# Altium project Coil_Driver.PrjPcb (part 1 of 3)
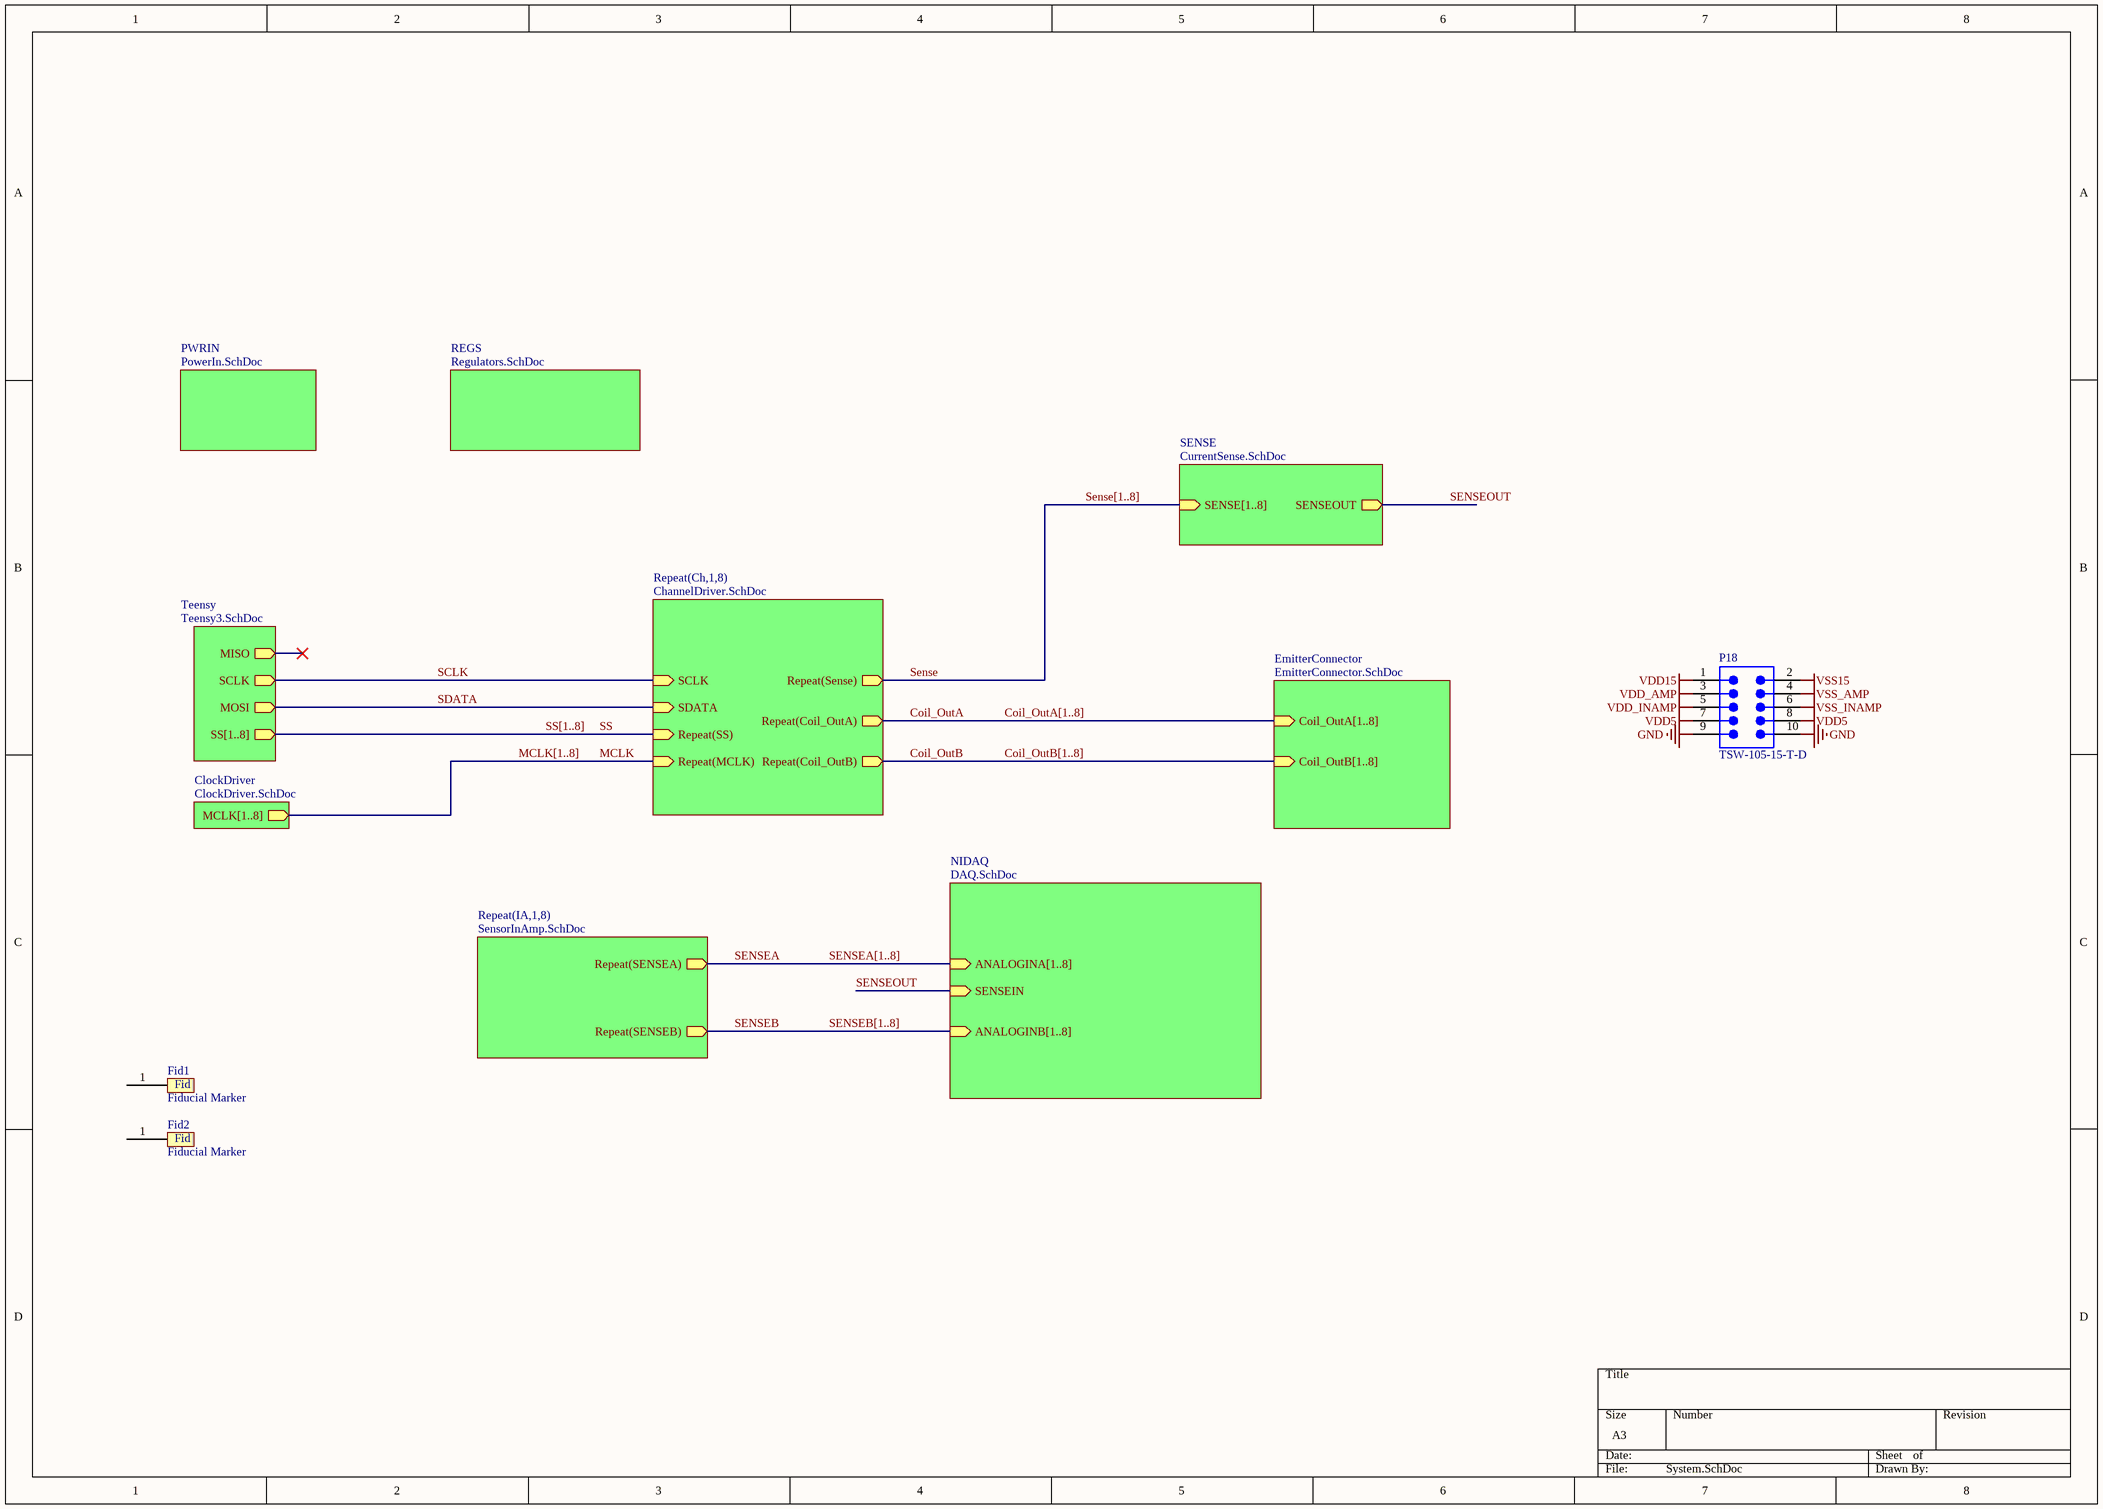
[diagram p0: System.SchDoc]
10 sheets, 1121 parts. Net scope: hierarchical (ports join the sheet entries above them; power ports are global).
Board file: PCB1.PcbDoc
Sheets:
  System.SchDoc
    Ch1 = ChannelDriver.SchDoc
    Ch2 = ChannelDriver.SchDoc
    Ch3 = ChannelDriver.SchDoc
    Ch4 = ChannelDriver.SchDoc
    Ch5 = ChannelDriver.SchDoc
    Ch6 = ChannelDriver.SchDoc
    Ch7 = ChannelDriver.SchDoc
    Ch8 = ChannelDriver.SchDoc
    Teensy = Teensy3.SchDoc
    ClockDriver = ClockDriver.SchDoc
    IA1 = SensorInAmp.SchDoc
    IA2 = SensorInAmp.SchDoc
    IA3 = SensorInAmp.SchDoc
    IA4 = SensorInAmp.SchDoc
    IA5 = SensorInAmp.SchDoc
    IA6 = SensorInAmp.SchDoc
    IA7 = SensorInAmp.SchDoc
    IA8 = SensorInAmp.SchDoc
    EmitterConnector = EmitterConnector.SchDoc
    NIDAQ = DAQ.SchDoc
    PWRIN = PowerIn.SchDoc
    REGS = Regulators.SchDoc
    SENSE = CurrentSense.SchDoc

## Sheet System.SchDoc
size A3

### Parts
Fid1  Fiducial Marker  [Fiducial]  (no BOM)
Fid2  Fiducial Marker  [Fiducial]  (no BOM)
P18  TSW-105-15-T-D  [SMTC-TSW-105-15-X-D]

### Sub-sheets
ClockDriver = ClockDriver.SchDoc: MCLK[1..8] (out)
EmitterConnector = EmitterConnector.SchDoc: Coil_OutA[1..8] (in), Coil_OutB[1..8] (in)
NIDAQ = DAQ.SchDoc: ANALOGINB[1..8] (in), ANALOGINA[1..8] (in), SENSEIN (in)
PWRIN = PowerIn.SchDoc: no entries
REGS = Regulators.SchDoc: no entries
Repeat(Ch,1,8) = ChannelDriver.SchDoc: SCLK (in), SDATA (in), Repeat(SS) (in), Repeat(MCLK) (in), Repeat(Coil_OutA) (out), Repeat(Coil_OutB) (out), Repeat(Sense) (out)
Repeat(IA,1,8) = SensorInAmp.SchDoc: Repeat(SENSEB) (out), Repeat(SENSEA) (out)
SENSE = CurrentSense.SchDoc: SENSE[1..8] (in), SENSEOUT (out)
Teensy = Teensy3.SchDoc: MOSI (out), SS[1..8] (out), SCLK (out), MISO (out)

### Nets
GND: P18.9 P18.10
VDD5: P18.7 P18.8
VDD15: P18.1
VDD_AMP: P18.3
VDD_INAMP: P18.5
VSS15: P18.2
VSS_AMP: P18.4
VSS_INAMP: P18.6
Coil_OutA: sheet Repeat(Ch,1,8)/Repeat(Coil_OutA)
Coil_OutB: sheet Repeat(Ch,1,8)/Repeat(Coil_OutB)
MCLK: sheet Repeat(Ch,1,8)/Repeat(MCLK)
SCLK: sheet Repeat(Ch,1,8)/SCLK, sheet Teensy/SCLK
SDATA: sheet Repeat(Ch,1,8)/SDATA, sheet Teensy/MOSI  [project net MOSI]
Sense: sheet Repeat(Ch,1,8)/Repeat(Sense)
SENSEA: sheet Repeat(IA,1,8)/Repeat(SENSEA)
SENSEB: sheet Repeat(IA,1,8)/Repeat(SENSEB)
SENSEOUT: sheet NIDAQ/SENSEIN, sheet SENSE/SENSEOUT  [project net SENSEIN]
SS: sheet Repeat(Ch,1,8)/Repeat(SS)

Not connected (* = marked no-connect by the designer): Fid1 1; Fid2 1

### Buses and harness runs
bus Coil_OutA[1..8] = sheet EmitterConnector/Coil_OutA[1..8]
bus Coil_OutB[1..8] = sheet EmitterConnector/Coil_OutB[1..8]
bus MCLK[1..8] = sheet ClockDriver/MCLK[1..8]
bus Sense[1..8] = sheet SENSE/SENSE[1..8]
bus SENSEA[1..8] = sheet NIDAQ/ANALOGINA[1..8]
bus SENSEB[1..8] = sheet NIDAQ/ANALOGINB[1..8]
bus SS[1..8] = sheet Teensy/SS[1..8]

### Notes on the sheet
- (in symbol Fiducial Marker) Fid

### Library data of the parts
P18 = CMP-1024-00368-1: Manufacturer: Samtec; Pitch: 2.54 mm; DatasheetVersion: F-214; PackageDescription: .025[0.64] SQ. Post Terminal Strip Assembly; PartNumber: TSW-105-15-T-D; PackageReference: TSW-105-15-X-D; ComponentLink2URL: http://www.samtec.com/documents/webfiles/pdf/TSW_TH.PDF; ComponentLink1URL: http://www.samtec.com; ComponentLink2Description: Datasheet; ComponentLink3Description: Package Specification; PackageVersion: DM, 8/1988; Mounting Technology: Through-hole; Temperature Range: -55 to 105 degC; ComponentLink1Description: Manufacturer URL; RoHS: True; ComponentLink3URL: http://www.samtec.com/documents/webfiles/cpdf/TSW-XXX-XX-XXX-X-XX-XXX-MKT.pdf; Orientation: Vertical

## Sheet ChannelDriver.SchDoc
size A3
Used 8 times, as channels Ch1, Ch2, Ch3, Ch4, Ch5, Ch6, Ch7, Ch8. Parts and nets are listed once, with the designators drawn on the sheet.
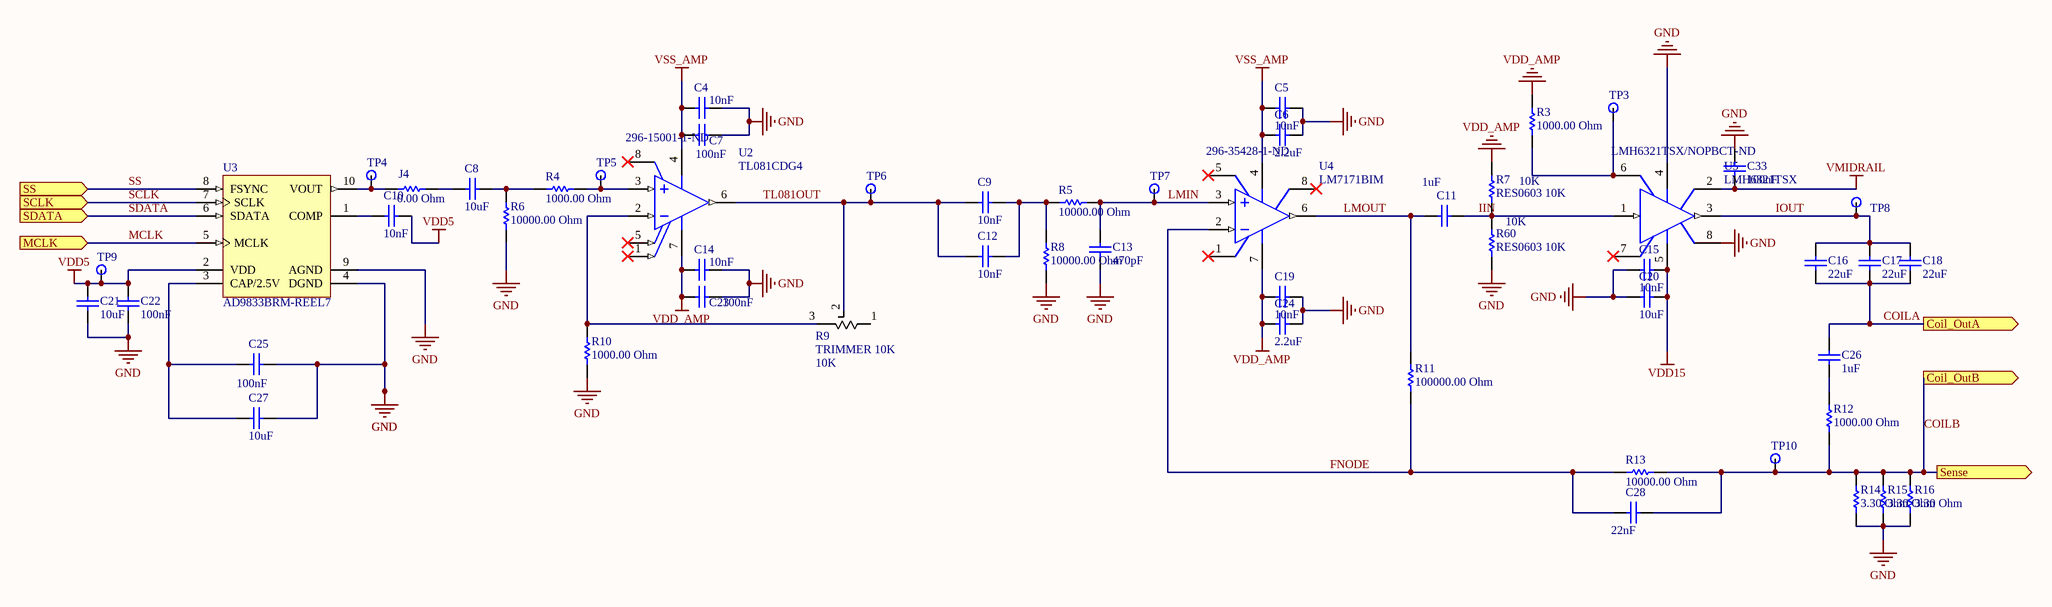
[diagram p1: ChannelDriver.SchDoc]

### Parts
C4  value 10nF  [CAPC0603(1608)100_N]  (hidden comment: CAP 10nF 25V 0603(1608))
C5  value 10nF  [CAPC0603(1608)100_N]  (hidden comment: CAP 10nF 25V 0603(1608))
C6  value 2.2uF  [CAPC0603(1608)100_M]  (hidden comment: CAP 2.2uF 25V 0603(1608))
C7  value 100nF  [CAPC0603(1608)100_M]  (hidden comment: CAP 100nF 25V 0603(1608))
C8  value 10uF  [CAPC1206(3216)190_L]  (hidden comment: CAP 10uF 25V 1206(3216))
C9  value 10nF  [CAPC0603(1608)100_N]  (hidden comment: CAP 10nF 25V 0603(1608))
C10  value 10nF  [CAPC0603(1608)100_N]  (hidden comment: CAP 10nF 25V 0603(1608))
C11  value 1uF  [CAPC0603(1608)100_L]  (hidden comment: CAP 1uF 25V 0603(1608))
C12  value 10nF  [CAPC0603(1608)100_N]  (hidden comment: CAP 10nF 25V 0603(1608))
C13  value 470pF  [CAPC0603(1608)100_N]  (hidden comment: CAP 470pF 25V 0603(1608))
C14  value 10nF  [CAPC0603(1608)100_N]  (hidden comment: CAP 10nF 25V 0603(1608))
C15  value 10nF  [CAPC0603(1608)100_N]  (hidden comment: CAP 10nF 25V 0603(1608))
C16  value 22uF  [CAPC1206(3216)190_M]  (hidden comment: CAP 22uF 25V 1206(3216))
C17  value 22uF  [CAPC1206(3216)190_M]  (hidden comment: CAP 22uF 25V 1206(3216))
C18  value 22uF  [CAPC1206(3216)190_M]  (hidden comment: CAP 22uF 25V 1206(3216))
C19  value 10nF  [CAPC0603(1608)100_N]  (hidden comment: CAP 10nF 25V 0603(1608))
C20  value 10uF  [CAPC1206(3216)190_L]  (hidden comment: CAP 10uF 25V 1206(3216))
C21  value 10uF  [CAPC1206(3216)190_L]  (hidden comment: CAP 10uF 25V 1206(3216))
C22  value 100nF  [CAPC0603(1608)100_M]  (hidden comment: CAP 100nF 25V 0603(1608))
C23  value 100nF  [CAPC0603(1608)100_M]  (hidden comment: CAP 100nF 25V 0603(1608))
C24  value 2.2uF  [CAPC0603(1608)100_M]  (hidden comment: CAP 2.2uF 25V 0603(1608))
C25  value 100nF  [CAPC0603(1608)100_M]  (hidden comment: CAP 100nF 25V 0603(1608))
C26  value 1uF  [CAPC0603(1608)100_L]  (hidden comment: CAP 1uF 25V 0603(1608))
C27  value 10uF  [CAPC1206(3216)190_L]  (hidden comment: CAP 10uF 25V 1206(3216))
C28  value 22nF  [CAPC0603(1608)100_N]  (hidden comment: CAP 22nF 25V 0603(1608))
C33  value 100nF  [CAPC0603(1608)100_M]  (hidden comment: CAP 100nF 25V 0603(1608))
J4  0.00 Ohm  [RESC1206(3216)_M]
R3  value 1000.00 Ohm  [RESC0603(1608)_L]  (hidden comment: 1K 5% 0603(1608))
R4  value 1000.00 Ohm  [RESC0603(1608)_L]  (hidden comment: 1K 5% 0603(1608))
R5  value 10000.00 Ohm  [RESC0603(1608)_N]  (hidden comment: 10K 5% 0603(1608))
R6  value 10000.00 Ohm  [RESC0603(1608)_N]  (hidden comment: 10K 5% 0603(1608))
R7  RES0603 10K  value 10K  [RESC0603(1608)_L]
R8  value 10000.00 Ohm  [RESC0603(1608)_N]  (hidden comment: 10K 5% 0603(1608))
R9  TRIMMER 10K  value 10K  [TRIMMER 10K]
R10  value 1000.00 Ohm  [RESC0603(1608)_L]  (hidden comment: 1K 5% 0603(1608))
R11  value 100000.00 Ohm  [RESC0603(1608)_N]  (hidden comment: 100K 5% 0603(1608))
R12  value 1000.00 Ohm  [RESC0603(1608)_L]  (hidden comment: 1K 5% 0603(1608))
R13  value 10000.00 Ohm  [RESC0603(1608)_N]  (hidden comment: 10K 5% 0603(1608))
R14  3.30 Ohm  [RESC1206(3216)_N]
R15  3.30 Ohm  [RESC1206(3216)_N]
R16  3.30 Ohm  [RESC1206(3216)_N]
R60  RES0603 10K  value 10K  [RESC0603(1608)_L]
TP3  Testpoint  [0603 PROBE PAD]  (value not drawn)
TP4  Testpoint  [0603 PROBE PAD]  (value not drawn)
TP5  Testpoint  [0603 PROBE PAD]  (value not drawn)
TP6  Testpoint  [0603 PROBE PAD]  (value not drawn)
TP7  Testpoint  [0603 PROBE PAD]  (value not drawn)
TP8  Testpoint  [0603 PROBE PAD]  (value not drawn)
TP9  Testpoint  [0603 PROBE PAD]  (value not drawn)
TP10  Testpoint  [0603 PROBE PAD]  (value not drawn)
U2  TL081CDG4  Supplier Part Number 1: 296-15001-1-ND  [TI-D8_N]
U3  AD9833BRM-REEL7  [ADI-RM-10_L]
U4  LM7171BIM  Supplier Part Number 1: 296-35428-1-ND  [D0008A_L]
U5  LMH6321TSX  Supplier Part Number 1: LMH6321TSX/NOPBCT-ND  [TS7B_N]

### Ports
Coil_OutA (out), Coil_OutB (out), MCLK (in), SCLK (in), SDATA (in), Sense (out), SS (in)

### Nets
GND: C4.2 C5.2 C6.2 C7.1 C13.1 C14.2 C15.1 C19.2 C20.2 C21.1 C22.2 C23.1 C24.2 C25.1 C27.1 C33.1 R6.2 R8.2 R10.2 R14.1 R15.1 R16.1 R60.1 U3.4(DGND) U3.9(AGND) U5.4(V-) U5.8(TAB)
VDD5: C10.2 C21.2 C22.1 TP9.0 U3.2(VDD)
VDD15: C15.2 C20.1 U5.5(V+)
VDD_AMP: C14.1 C19.1 C23.2 C24.1 R3.1 R7.2 U2.7(VCC+) U4.7(V+)
VMIDRAIL: C33.2 U5.2(GND)
VSS_AMP: C4.1 C5.1 C6.1 C7.2 U2.4(VCC-) U4.4(V-)
COILA: C16.2 C17.2 C18.2 C26.2 ; port Coil_OutA
COILB: C28.2 R12.2 R13.1 R14.2 R15.2 R16.2 TP10.0 ; port Coil_OutB, port Sense
FNODE: C28.1 R11.2 R13.2 U4.2(IN-)
IIN: C11.2 R7.1 R60.2 U5.1(IN)
IOUT: C16.1 C17.1 C18.1 TP8.0 U5.3(OUT)
LMIN: C13.2 R5.1 TP7.0 U4.3(IN+)
LMOUT: C11.1 R11.1 U4.6(OUT)
MCLK: U3.5(MCLK) ; port MCLK
SCLK: U3.7(SCLK) ; port SCLK
SDATA: U3.6(SDATA) ; port SDATA
SS: U3.8(FSYNC) ; port SS
TL081OUT: C9.1 C12.1 R9.2 TP6.0 U2.6(OUT)
NetC8_1: C8.1 R4.2 R6.1
NetC8_2: C8.2 J4.2
NetC9_2: C9.2 C12.2 R5.2 R8.1
NetC10_1: C10.1 U3.1(COMP)
NetC25_2: C25.2 C27.2 U3.3(CAP/2.5V)
NetC26_1: C26.1 R12.1
NetJ4_1: J4.1 TP4.0 U3.10(VOUT)
NetR3_2: R3.2 TP3.0 U5.6(EF)
NetR4_1: R4.1 TP5.0 U2.3(IN+)
NetR9_3: R9.3 R10.1 U2.2(IN-)

Not connected (* = marked no-connect by the designer): R9 1; U2 1(OFFSET_N1)* 5(OFFSET_N2)* 8(NC)*; U4 1(NC)* 5(NC)* 8(NC)*; U5 7(CL)*

### Channels
Ch1: designators end in _Ch1; ports Coil_OutA=Coil_Out1 Coil_OutB=Coil_In1 MCLK=MCLK SCLK=SCLK SDATA=MOSI Sense=Coil_In1 SS=SS
Ch2: designators end in _Ch2; ports Coil_OutA=Coil_Out2 Coil_OutB=Coil_In2 MCLK=MCLK SCLK=SCLK SDATA=MOSI Sense=Coil_In2 SS=SS
Ch3: designators end in _Ch3; ports Coil_OutA=Coil_Out3 Coil_OutB=Coil_In3 MCLK=MCLK SCLK=SCLK SDATA=MOSI Sense=Coil_In3 SS=SS
Ch4: designators end in _Ch4; ports Coil_OutA=Coil_Out4 Coil_OutB=Coil_In4 MCLK=MCLK SCLK=SCLK SDATA=MOSI Sense=Coil_In4 SS=SS
Ch5: designators end in _Ch5; ports Coil_OutA=Coil_Out5 Coil_OutB=Coil_In5 MCLK=MCLK SCLK=SCLK SDATA=MOSI Sense=Coil_In5 SS=SS
Ch6: designators end in _Ch6; ports Coil_OutA=Coil_Out6 Coil_OutB=Coil_In6 MCLK=MCLK SCLK=SCLK SDATA=MOSI Sense=Coil_In6 SS=SS
Ch7: designators end in _Ch7; ports Coil_OutA=Coil_Out7 Coil_OutB=Coil_In7 MCLK=MCLK SCLK=SCLK SDATA=MOSI Sense=Coil_In7 SS=SS
Ch8: designators end in _Ch8; ports Coil_OutA=Coil_Out8 Coil_OutB=Coil_In8 MCLK=MCLK SCLK=SCLK SDATA=MOSI Sense=Coil_In8 SS=SS

### Library data of the parts
C4 C5 C9 C10 C12 C14 C15 C19 = CMP-1035-02317-1: CAP 10nF 25V ±10% 0603 (1608 Metric) Thickness 1mm SMD; Tolerance: Â±10%; Case-Metric: 1608; Case-EIA: 0603; Max Thickness: 1 mm; Rated Voltage: 25 V; Technology: SMT; OrderURL: http://www.digikey.ie/product-detail/en/yageo/CC0603KRX7R8BB103/311-1360-1-ND/2103144; Supplier 1: Digi-Key; Supplier Part Number 1: 311-1360-1-ND
C6 C24 = CMP-1035-02767-1: CAP 2.2uF 25V ±10% 0603 (1608 Metric) Thickness 1mm SMD; Manufacturer: Taiyo Yuden; Manufacturer Part Number: TMK107ABJ225KA-T; Case-EIA: 0603; Tolerance: Â±10%; Case-Metric: 1608; Capacitance: 2.2µF; Temperature Coefficient: X5R; Technology: SMT; Max Thickness: 1 mm; Rated Voltage: 25 V; OrderURL: http://www.digikey.ie/product-detail/en/taiyo-yuden/TMK107ABJ225KA-T/587-2909-1-ND/2649029; Supplier 1: Digi-Key; Supplier Part Number 1: 587-2909-1-ND; RoHS: RoHS Compliant; Category: Capacitors; Stock 1: 107583; Pricing 1: 1=0.16, 10=0.112, 25=0.0816, 50=0.0632, 100=0.0525, 250=0.04344, 500=0.03678, 1000=0.03045 (EUR); Packaging: Cut Tape (CT); Part Status: Active; Voltage - Rated: 25V; Operating Temperature: -55°C ~ 85°C; Features: -; Ratings: -; Applications: General Purpose; Mounting Type: Surface Mount, MLCC; Package / Case: 0603 (1608 Metric); Size / Dimension: 0.063" L x 0.031" W (1.60mm x 0.80mm); Height - Seated (Max): -; Thickness (Max): 0.035" (0.90mm); Lead Spacing: -; Lead Style: -; ComponentLink1URL: http://ds.yuden.co.jp/TYCOMPAS/ut/detail.do?productNo=TMK107ABJ225KA-T&fileName=TMK107ABJ225KA-T_SS&mode=specSheetDownload; ComponentLink1Description: http://ds.yuden.co.jp/TYCOMPAS/ut/detail.do?productNo=TMK107ABJ225KA-T&fileName=TMK107ABJ225KA-T_SS&mode=specSheetDownload
C7 C22 C23 C25 C33 = CMP-1035-02588-1: CAP 100nF 25V ±10% 0603 (1608 Metric) Thickness 1mm SMD; Case-Metric: 1608; Case-EIA: 0603; Tolerance: Â±10%; Max Thickness: 1 mm; Technology: SMT; Rated Voltage: 25 V; OrderURL: http://www.digikey.ie/product-detail/en/yageo/CC0603KRX7R8BB104/311-1341-1-ND/2103125; Supplier 1: Digi-Key; Supplier Part Number 1: 311-1341-1-ND
C8 C20 C21 C27 = CMP-1037-04979-1: CAP 10uF 25V ±10% 1206 (3216 Metric) Thickness 1.9mm SMD; Case-EIA: 1206; Tolerance: Â±10%; Case-Metric: 3216; Rated Voltage: 25 V; Technology: SMT; Max Thickness: 1.9 mm; OrderURL: http://www.digikey.ie/product-detail/en/murata-electronics-north-america/GRM319R61E106KA12D/490-5525-1-ND/2334921; Supplier 1: Digi-Key; Supplier Part Number 1: 490-5525-1-ND
C11 C26 = CMP-1035-02740-1: CAP 1uF 25V ±10% 0603 (1608 Metric) Thickness 1mm SMD; Tolerance: Â±10%; Case-Metric: 1608; Case-EIA: 0603; Technology: SMT; Rated Voltage: 25 V; Max Thickness: 1 mm; OrderURL: http://www.digikey.ie/product-detail/en/taiyo-yuden/TMK107BJ105KA-T/587-1248-1-ND/931025; Supplier Part Number 1: 587-1248-1-ND; Supplier 1: Digi-Key
C13 = CMP-1035-01671-1: CAP 470pF 25V ±10% 0603 (1608 Metric) Thickness 1mm SMD; Manufacturer: KEMET; Manufacturer Part Number: C0603C471K3RACTU; Case-EIA: 0603; Tolerance: Â±10%; Case-Metric: 1608; Temperature Coefficient: X7R; Technology: SMT; Max Thickness: 1 mm; Rated Voltage: 25 V; OrderURL: http://www.digikey.ie/product-detail/en/kemet/C0603C471K3RACTU/399-9086-1-ND/3522603; Supplier 1: Digi-Key; Supplier Part Number 1: 399-9086-1-ND; RoHS: RoHS Compliant; Category: Capacitors; Stock 1: 50558; Pricing 1: 1=0.09, 10=0.044, 25=0.032, 50=0.024, 100=0.0196, 250=0.01644, 500=0.01402, 1000=0.01102 (EUR); Packaging: Cut Tape (CT); Part Status: Active; Capacitance: 470pF; Voltage - Rated: 25V; Operating Temperature: -55°C ~ 125°C; Features: -; Ratings: -; Applications: General Purpose; Failure Rate: -; Mounting Type: Surface Mount, MLCC; Package / Case: 0603 (1608 Metric); Size / Dimension: 0.063" L x 0.031" W (1.60mm x 0.80mm); Height - Seated (Max): -; Thickness (Max): 0.034" (0.87mm); Lead Spacing: -; Lead Style: -; ComponentLink1URL: http://www.kemet.com/docfinder?Partnumber=C0603C471K3RACTU; ComponentLink1Description: http://www.kemet.com/docfinder?Partnumber=C0603C471K3RACTU
C16-C18 = CMP-1037-04995-1: CAP 22uF 25V ±20% 1206 (3216 Metric) Thickness 1.9mm SMD; Case-EIA: 1206; Tolerance: Â±20%; Case-Metric: 3216; Rated Voltage: 25 V; Technology: SMT; Max Thickness: 1.9 mm; OrderURL: http://www.digikey.ie/product-detail/en/taiyo-yuden/TMK316BBJ226ML-T/587-3246-1-ND/3660105; Supplier Part Number 1: 587-3246-1-ND; Supplier 1: Digi-Key
C28 = CMP-1035-02317-1: CAP 10nF 25V ±10% 0603 (1608 Metric) Thickness 1mm SMD; Manufacturer: Taiyo Yuden; Manufacturer Part Number: TMK107B7223KA-T; Tolerance: Â±10%; Case-Metric: 1608; Case-EIA: 0603; Temperature Coefficient: X7R; Max Thickness: 1 mm; Rated Voltage: 25 V; Technology: SMT; OrderURL: http://www.digikey.ie/product-detail/en/yageo/CC0603KRX7R8BB103/311-1360-1-ND/2103144; Supplier 1: Digi-Key; Supplier Part Number 1: 587-1238-1-ND; RoHS: RoHS Compliant; Category: Capacitors; Stock 1: 40253; Pricing 1: 1=0.08, 10=0.052, 100=0.0232, 500=0.01652, 1000=0.01299 (EUR); Packaging: Cut Tape (CT); Part Status: Active; Voltage - Rated: 25V; Operating Temperature: -55°C ~ 125°C; Features: -; Ratings: -; Applications: General Purpose; Mounting Type: Surface Mount, MLCC; Package / Case: 0603 (1608 Metric); Size / Dimension: 0.063" L x 0.032" W (1.60mm x 0.80mm); Height - Seated (Max): -; Thickness (Max): 0.035" (0.90mm); Lead Spacing: -; Lead Style: -; ComponentLink1URL: http://www.yuden.co.jp/productdata/catalog/en/mlcc_all_e.pdf; ComponentLink1Description: http://www.yuden.co.jp/productdata/catalog/en/mlcc_all_e.pdf
J4 = CMP-1014-00001-1: Jumper 1206 (3216 Metric); Tolerance: None; Case-EIA: 1206; Case-Metric: 3216; Technology: SMT; Power: None; Value: 0.00 Ohm; OrderURL: http://www.digikey.ie/product-detail/en/yageo/RC0603JR-070RL/311-0.0GRCT-ND/729622; Supplier 1: Digi-Key; Supplier Part Number 1: 311-0.0GRCT-ND
R3 R4 R10 R12 = CMP-1012-00074-1: 1K 0.1W 5% 0603 (1608 Metric)  SMD; Case-EIA: 0603; Case-Metric: 1608; Technology: SMT; Tolerance: 5 %; Power: 0.1 W; OrderURL: http://www.digikey.ie/product-detail/en/yageo/RC0603JR-071KL/311-1.0KGRCT-ND/729624; Supplier 1: Digi-Key; Supplier Part Number 1: 311-1.0KGRCT-ND
R5 R6 R8 R13 = CMP-1012-00098-1: 10K 0.1W 5% 0603 (1608 Metric)  SMD; Case-EIA: 0603; Case-Metric: 1608; Technology: SMT; Tolerance: 5 %; Power: 0.1 W; OrderURL: http://www.digikey.ie/product-detail/en/yageo/RC0603JR-0710KL/311-10KGRCT-ND/729647; Supplier 1: Digi-Key; Supplier Part Number 1: 311-10KGRCT-ND
R7 R60 = CMP-1591-00001-1: 0603 (1608 Metric) Chip Resistor; Manufacturer: Yageo; Manufacturer Part Number: RT0603BRD0710KL; Case-Metric: 1608; Case-EIA: 0603; Power (Watts): 0.1W, 1/10W; Temperature Coefficient: ±25ppm/°C; PackageReference: RESC0603(1608); Supplier 1: Digi-Key; Supplier Part Number 1: YAG1236CT-ND; RoHS: RoHS Compliant; Category: Resistors; Stock 1: 62928; Pricing 1: 1=0.3, 10=0.254, 25=0.1844, 50=0.1336, 100=0.0991, 250=0.07608, 500=0.05994, 1000=0.0415 (EUR); Packaging: Cut Tape (CT); Part Status: Active; Resistance (Ohms): 10k; Composition: Thin Film; Features: Moisture Resistant; Operating Temperature: -55°C ~ 155°C; Package / Case: 0603 (1608 Metric); Supplier Device Package: 0603; Size / Dimension: 0.063" L x 0.031" W (1.60mm x 0.80mm); Height - Seated (Max): 0.022" (0.55mm); Failure Rate: -; ComponentLink1URL: http://www.yageo.com/documents/recent/PYu-RT_1-to-0.01_RoHS_L_7.pdf; ComponentLink1Description: http://www.yageo.com/documents/recent/PYu-RT_1-to-0.01_RoHS_L_7.pdf
R9 = TRIMMER 10K: TRIMMER 10K OHM 0.5W TH; Manufacturer: TE Connectivity Passive Product; Manufacturer Part Number: 1-1623849-0; Power (Watts): 0.5W, 1/2W; Tolerance: ±10%; Temperature Coefficient: ±100ppm/°C; Number of Turns: 25; Adjustment Type: Top Adjustment; Resistive Material: Cermet; Published: 8-Jun-2000; LatestRevisionDate: 29-May-2009; LatestRevisionNote: IPC-7351 Footprint Added.; PackageReference: J1-0603; Publisher: Altium Limited; PackageDescription: Chip Resistor; RoHS: RoHS Compliant; Category: Potentiometers, Variable Resistors; Packaging: Bulk; Part Status: Active; Resistance (Ohms): 10k; Mounting Type: Through Hole; Termination Style: PC Pins; Size / Dimension: Rectangular - 0.374" x 0.185" Face x 0.394" H (9.50mm x 4.70mm x 10.00mm); ComponentLink1URL: http://www.te.com/commerce/DocumentDelivery/DDEController?Action=srchrtrv&DocNm=1623849&DocType=Customer+Drawing&DocLang=English; ComponentLink1Description: http://www.te.com/commerce/DocumentDelivery/DDEController?Action=srchrtrv&DocNm=1623849&DocType=Customer+Drawing&DocLang=English; Supplier 1: Digi-Key; Supplier Part Number 1: A105870-ND; Stock 1: 5809; Pricing 1: 1=0.89, 10=0.786, 25=0.7076, 50=0.6816, 100=0.6554, 250=0.61608, 500=0.5243, 1000=0.48499, 5000=0.39848 (EUR)
R11 = CMP-1012-00122-1: 100K 0.1W 5% 0603 (1608 Metric)  SMD; Case-EIA: 0603; Case-Metric: 1608; Tolerance: 5 %; Power: 0.1 W; Technology: SMT; OrderURL: http://www.digikey.ie/product-detail/en/yageo/RC0603JR-07100KL/311-100KGRCT-ND/729645; Supplier Part Number 1: 311-100KGRCT-ND; Supplier 1: Digi-Key
R14-R16 = CMP-1014-00014-1: 3R3 0.25W 5% 1206 (3216 Metric)  SMD; Manufacturer: Yageo; Manufacturer Part Number: RC0603FR-073R32L; Case-EIA: 1206; Case-Metric: 3216; Resistance (Ohms): 3.32; Power (Watts): 0.1W, 1/10W; Temperature Coefficient: ±200ppm/°C; Power: 0.25 W; Tolerance: 5 %; Technology: SMT; Value: 3.30 Ohm; Supplier 1: Digi-Key; Supplier Part Number 1: 311-3.32HRCT-ND; RoHS: RoHS Compliant; Category: Resistors; Stock 1: 33932; Pricing 1: 1=0.09, 10=0.018, 25=0.0132, 50=0.0098, 100=0.0073, 250=0.0056, 500=0.00446, 1000=0.00329 (EUR); Packaging: Cut Tape (CT); Part Status: Active; Composition: Thick Film; Features: Moisture Resistant; Operating Temperature: -55°C ~ 155°C; Package / Case: 0603 (1608 Metric); Supplier Device Package: 0603; Size / Dimension: 0.063" L x 0.031" W (1.60mm x 0.80mm); Height - Seated (Max): 0.022" (0.55mm); Number of Terminations: 2; Failure Rate: -; ComponentLink1URL: http://www.yageo.com/documents/recent/PYu-RC_Group_51_RoHS_L_6.pdf; ComponentLink1Description: http://www.yageo.com/documents/recent/PYu-RC_Group_51_RoHS_L_6.pdf
TP3-TP10 = Testpoint: 0.063" x 0.031" x 0.045" (1.60mm x 0.80mm x 1.15mm); OrderURL: http://www.digikey.ie/product-detail/en/te-connectivity-amp-connectors/RCU-0C/A106145CT-ND/3477802; Value: *; Width: 0.8; Height: 1.15mm; Length: 1.60mm; Supplier Part Number 1: A106145CT-ND; Supplier 1: Digi-Key
U2 = CMP-0017-00506-1: JFET-Input Operational Amplifier, 7 to 36 V, 0 to 70 degC, 8-pin SOIC (D8), Green (RoHS & no Sb/Br); Manufacturer: Texas Instruments; Manufacturer Part Number: TL081CDR; Total Supply Voltage(Min)(+5V is 5, +/-5V is 10): 7; Rating: Military; CMRR(Min)(dB): 70; IIB(Max)(pA): 400; Iq per channel(Max)(mA): 2.8; Vio (25C)(Max)(mV): 15; Vn at 1kHz(Typ)(nV/rtHz): 18; Slew Rate(Typ)(V/us): 13; Sub Family: General Purpose Amplifier, High Supply Voltage Amplifier (>=30V); Total Supply Voltage(Max)(+5V is 5, +/-5V is 10): 36; Number of Channels: 1; GBW(Typ)(MHz): 3; Amplifier Type: J-FET; Slew Rate: 13 V/µs; Gain Bandwidth Product: 3MHz; Current - Input Bias: 30pA; Voltage - Input Offset: 3mV; Current - Supply: 1.4mA; Voltage - Supply, Single/Dual (±): 7 V ~ 36 V, ±3.5 V ~ 18 V; ComponentLink3Description: Package Specification; Eco-Plan: Green (RoHS & no Sb/Br); PackageReference: D8; ComponentLink1Description: Manufacturer URL; PackageDescription: 8-Pin Plastic Small Outline, Body 4.9 x 3.9 mm, Pitch 1.27 mm; DatasheetVersion: SLOS081G; PackageVersion: 4040047-3/M, 06/2011; Code_JEDEC: MS-012; ComponentLink2URL: http://www.ti.com/lit/ds/symlink/tl081.pdf; ComponentLink1URL: http://www.ti.com/; Offset Drift(Typ)(uV/C): 18; Mounting Technology: Surface Mount; ComponentLink2Description: Datasheet; PartNumber: TL081CDG4; ComponentLink3URL: http://www.ti.com/litv/pdf/msoi002j; OrderURL: http://www.digikey.ie/product-detail/en/texas-instruments/TL081CDR/296-15001-1-ND/562657; Supplier 1: Digi-Key; RoHS: RoHS Compliant; Category: Integrated Circuits (ICs); Stock 1: 9909; Pricing 1: 1=0.44, 10=0.375, 100=0.28, 500=0.22002, 1000=0.17001 (EUR); Packaging: Cut Tape (CT); Part Status: Active; Number of Circuits: 1; Output Type: -; -3db Bandwidth: -; Current - Output / Channel: -; Operating Temperature: 0°C ~ 70°C; Mounting Type: Surface Mount; Package / Case: 8-SOIC (0.154", 3.90mm Width); Supplier Device Package: 8-SOIC; ComponentLink4URL: http://www.ti.com/lit/ds/symlink/tl081a.pdf; ComponentLink4Description: http://www.ti.com/lit/ds/symlink/tl081a.pdf
U3 = CMP-0293-00080-1: Low Power, 12.65 mW, 2.3 V to 5.5 V, Programmable Waveform Generator, 10-Bit, Serial, RM-10, 1000 Reel; Manufacturer: Analog Devices Inc.; Manufacturer Part Number: AD9833BRMZ-REEL7; Compliance Range (V): 650mV; Master fclk: 25MHz; I Supply total (max): 5.5mA; FS Iout (mA nom): 3mA; Resolution (Bits): 10bit; Tuning Word Width (bits): 28bit; REFCLK Multiplier: No; Voltage - Supply: 2.3 V ~ 5.5 V; ComponentLink2Description: Datasheet; ComponentLink2URL: http://www.analog.com/static/imported-files/data_sheets/AD9833.pdf; PackageReference: RM-10; ComponentLink3Description: Package Specification; DatasheetVersion: Rev. D; ComponentLink1URL: www.analog.com; PackageVersion: 5/8/2005; ComponentLink3URL: http://www.analog.com/static/imported-files/packages/PKG_PDF/MSOP%28RM%29/RM_10.pdf; I/O Interface: Serial; ComponentLink1Description: Manufacturer URL; PackageDescription: 10-Lead Mini Small Outline Package [MSOP]; Code_JEDEC: MO-187-BA; OrderURL: http://www.digikey.ie/product-detail/en/analog-devices-inc/AD9833BRMZ/AD9833BRMZ-ND/751220; Supplier 1: Digi-Key; Supplier Part Number 1: AD9833BRMZ-REEL7CT-ND; RoHS: RoHS Compliant; Category: Integrated Circuits (ICs); Stock 1: 3129; Pricing 1: 1=9.42, 10=8.507, 100=7.0426, 500=6.13264 (EUR); Packaging: Cut Tape (CT); Part Status: Active; Operating Temperature: -40°C ~ 125°C; Mounting Type: Surface Mount; Package / Case: 10-TFSOP, 10-MSOP (0.118", 3.00mm Width); Supplier Device Package: 10-MSOP; ComponentLink4URL: http://www.analog.com/media/en/technical-documentation/data-sheets/AD9833.pdf; ComponentLink4Description: http://www.analog.com/media/en/technical-documentation/data-sheets/AD9833.pdf
U4 = CMP-0055-00670-3: Very High Speed, High Output Current, Voltage Feedback Amplifier, 8-pin Narrow SOIC; Manufacturer: Texas Instruments; Manufacturer Part Number: LM7171AIMX/NOPB; PackageTopMarking: NSZXTT*LM71*71BIM; CompType: Amplifiers; PowerWise: N; Number of Circuits: 1; Slew Rate: 4100 V/µs; Gain Bandwidth Product: 200MHz; -3db Bandwidth: 220MHz; Current - Input Bias: 2.7µA; Voltage - Input Offset: 200µV; Current - Supply: 6.5mA; Current - Output / Channel: 118mA; Voltage - Supply, Single/Dual (±): 5.5 V ~ 36 V, ±2.75 V ~ 18 V; ComponentLink1Description: Datasheet URL; RoHS: N; Package Reference: D0008A; Code_JEDEC: MS-012-AA; Code_IPC: SOIC127P600-8; PinCount: 8; ComponentLink1URL: http://www.ti.com/general/docs/lit/getliterature.tsp?genericPartNumber=LM7171&fileType=pdf; PackageDescription: SOIC Narrow, 4.9 x 3.9 x 1.45mm, 8 Lead, 1.27mm Pitch; OrderURL: http://www.digikey.ie/product-detail/en/texas-instruments/LM7171BIMX-NOPB/LM7171BIMX-NOPBCT-ND/3767451; Supplier 1: Digi-Key; Category: Integrated Circuits (ICs); Stock 1: 3018; Pricing 1: 1=3.07, 10=2.76, 100=2.2615, 500=1.9251, 1000=1.62358 (EUR); Packaging: Cut Tape (CT); Part Status: Active; Amplifier Type: Voltage Feedback; Output Type: -; Operating Temperature: -40°C ~ 85°C; Mounting Type: Surface Mount; Package / Case: 8-SOIC (0.154", 3.90mm Width); Supplier Device Package: 8-SOIC; ComponentLink2URL: http://www.ti.com/lit/ds/symlink/lm7171.pdf; ComponentLink2Description: http://www.ti.com/lit/ds/symlink/lm7171.pdf
U5 = CMP-0055-00076-2: 300 mA High Speed Buffer with Adjustable Current Limit, 7-pin TO-263; Manufacturer: National Semiconductor; Manufacturer Part Number: LMH6321TSX/NOPB; CompType: Amplifiers; PackageTopMarking: NSUZXYTTE#*LMH6321TS; PowerWise: N; Number of Circuits: 1; Slew Rate: 2900 V/µs; -3db Bandwidth: 110MHz; Current - Input Bias: 2µA; Voltage - Input Offset: 4mV; Current - Supply: 14.9mA; Current - Output / Channel: 295mA; Voltage - Supply, Single/Dual (±): 5 V ~ 32 V, ±2.5 V ~ 16 V; ComponentLink2Description: LMH6321 Web Page; RoHS: N; ComponentLink3Description: TS7B Package Page; ComponentLink1URL: http://www.national.com/ds/LM/LMH6321.pdf; ComponentLink1Description: LMH6321 Datasheet; ComponentLink3URL: http://www.national.com/packaging/folders/ts7b.html; PinCount: 7; DatasheetVersion: Apr-2007; PackageReference: TS7B; RevisionNote: Component URLs added; PackageDescription: TO-263, Molded, .400 x .390 x .180in Body, 7 Lead, .050in Pitch, Surface Mount; PackageVersion: revE, Jul-2003; ComponentLink2URL: http://www.national.com/pf/LM/LMH6321.html; Code_JEDEC: MO-169-AC; OrderURL: http://www.digikey.ie/product-detail/en/texas-instruments/LMH6321TS-NOPB/LMH6321TS-NOPB-ND/1117634; Supplier 1: Digi-Key; Category: Integrated Circuits (ICs); Stock 1: 487; Pricing 1: 1=4.79, 10=4.305, 100=3.5271 (EUR); Packaging: Cut Tape (CT); Part Status: Active; Amplifier Type: Buffer; Output Type: -; Gain Bandwidth Product: -; Operating Temperature: -40°C ~ 125°C; Mounting Type: Surface Mount; Package / Case: TO-263-8, D²Pak (7 Leads + Tab), TO-263CA; Supplier Device Package: DDPAK/TO-263-7; ComponentLink4URL: http://www.ti.com/lit/ds/symlink/lmh6321.pdf; ComponentLink4Description: http://www.ti.com/lit/ds/symlink/lmh6321.pdf

## Sheet Teensy3.SchDoc
size A4
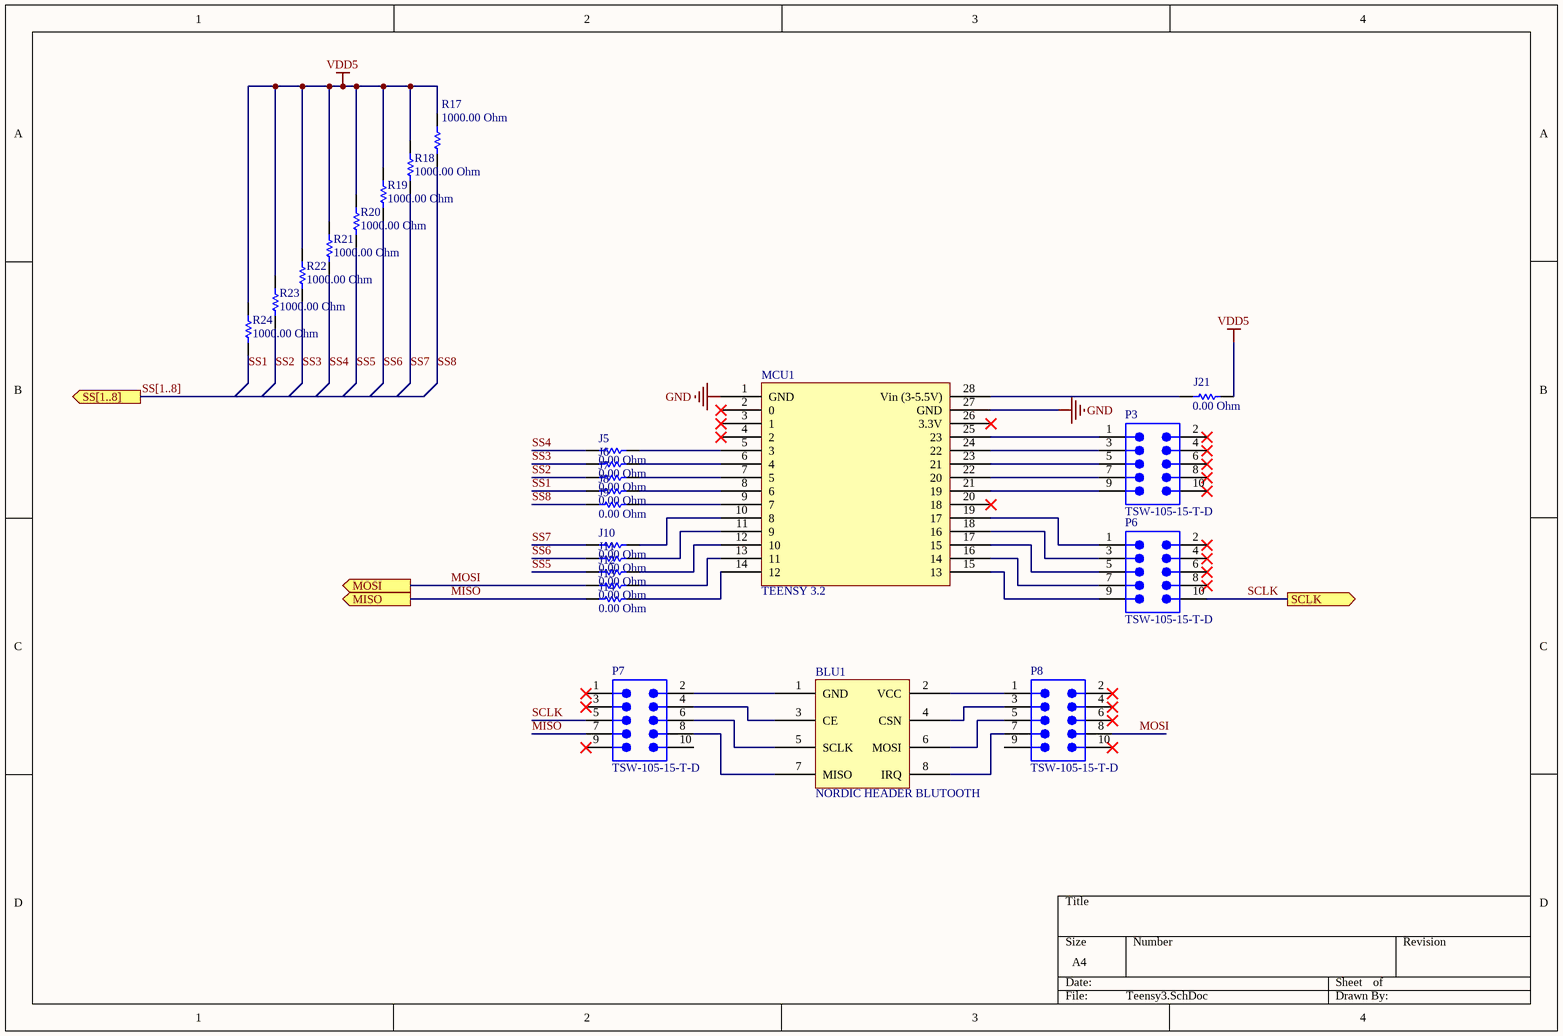
[diagram p2: Teensy3.SchDoc]

### Parts
BLU1  NORDIC HEADER BLUTOOTH  [NORDIC BLUTOOTH HEADER]
J5  0.00 Ohm  [RESC1206(3216)_M]
J6  0.00 Ohm  [RESC1206(3216)_M]
J7  0.00 Ohm  [RESC1206(3216)_M]
J8  0.00 Ohm  [RESC1206(3216)_M]
J9  0.00 Ohm  [RESC1206(3216)_M]
J10  0.00 Ohm  [RESC1206(3216)_M]
J11  0.00 Ohm  [RESC1206(3216)_M]
J12  0.00 Ohm  [RESC1206(3216)_M]
J13  0.00 Ohm  [RESC1206(3216)_M]
J14  0.00 Ohm  [RESC1206(3216)_M]
J21  0.00 Ohm  [RESC1206(3216)_M]
MCU1  TEENSY 3.2  [TEENSY 3.1]
P3  TSW-105-15-T-D  [SMTC-TSW-105-15-X-D]
P6  TSW-105-15-T-D  [SMTC-TSW-105-15-X-D]
P7  TSW-105-15-T-D  [SMTC-TSW-105-15-X-D]
P8  TSW-105-15-T-D  [SMTC-TSW-105-15-X-D]
R17  value 1000.00 Ohm  [RESC0603(1608)_L]  (hidden comment: 1K 5% 0603(1608))
R18  value 1000.00 Ohm  [RESC0603(1608)_L]  (hidden comment: 1K 5% 0603(1608))
R19  value 1000.00 Ohm  [RESC0603(1608)_L]  (hidden comment: 1K 5% 0603(1608))
R20  value 1000.00 Ohm  [RESC0603(1608)_L]  (hidden comment: 1K 5% 0603(1608))
R21  value 1000.00 Ohm  [RESC0603(1608)_L]  (hidden comment: 1K 5% 0603(1608))
R22  value 1000.00 Ohm  [RESC0603(1608)_L]  (hidden comment: 1K 5% 0603(1608))
R23  value 1000.00 Ohm  [RESC0603(1608)_L]  (hidden comment: 1K 5% 0603(1608))
R24  value 1000.00 Ohm  [RESC0603(1608)_L]  (hidden comment: 1K 5% 0603(1608))

### Ports
MISO (out), MOSI (out), SCLK (out), SS[1..8] (out)

### Nets
GND: MCU1.1(GND) MCU1.27(GND)
VDD5: J21.2 R17.1 R18.1 R19.1 R20.1 R21.1 R22.1 R23.1 R24.1
MISO: J14.1 P7.7 ; port MISO
MOSI: J13.1 P8.8 ; port MOSI
SCLK: P6.10 P7.5 ; port SCLK
SS1: J8.1 R24.2  [project net SS]
SS2: J7.1 R23.2  [project net SS]
SS3: J6.1 R22.2  [project net SS]
SS4: J5.1 R21.2  [project net SS]
SS5: J12.1 R20.2  [project net SS]
SS6: J11.1 R19.2  [project net SS]
SS7: J10.1 R18.2  [project net SS]
SS8: J9.1 R17.2  [project net SS]
NetBLU1_1: BLU1.1(GND) P7.2
NetBLU1_2: BLU1.2(VCC) P8.1
NetBLU1_3: BLU1.3(CE) P7.4
NetBLU1_4: BLU1.4(CSN) P8.3
NetBLU1_5: BLU1.5(SCLK) P7.6
NetBLU1_6: BLU1.6(MOSI) P8.5
NetBLU1_7: BLU1.7(MISO) P7.8
NetBLU1_8: BLU1.8(IRQ) P8.7
NetJ5_2: J5.2 MCU1.5(3)
NetJ6_2: J6.2 MCU1.6(4)
NetJ7_2: J7.2 MCU1.7(5)
NetJ8_2: J8.2 MCU1.8(6)
NetJ9_2: J9.2 MCU1.9(7)
NetJ10_2: J10.2 MCU1.10(8)
NetJ11_2: J11.2 MCU1.11(9)
NetJ12_2: J12.2 MCU1.12(10)
NetJ13_2: J13.2 MCU1.13(11)
NetJ14_2: J14.2 MCU1.14(12)
NetJ21_1: J21.1 MCU1.28(Vin_(3-5.5V))
NetMCU1_15: MCU1.15(13) P6.9
NetMCU1_16: MCU1.16(14) P6.7
NetMCU1_17: MCU1.17(15) P6.5
NetMCU1_18: MCU1.18(16) P6.3
NetMCU1_19: MCU1.19(17) P6.1
NetMCU1_21: MCU1.21(19) P3.9
NetMCU1_22: MCU1.22(20) P3.7
NetMCU1_23: MCU1.23(21) P3.5
NetMCU1_24: MCU1.24(22) P3.3
NetMCU1_25: MCU1.25(23) P3.1

Not connected (* = marked no-connect by the designer): MCU1 2(0)* 3(1)* 4(2)* 20(18)* 26(3.3V)*; P3 2* 4* 6* 8* 10*; P6 2* 4* 6* 8*; P7 1* 3* 9* 10; P8 2* 4* 6* 9 10*

### Buses and harness runs
bus SS[1..8] = port SS[1..8]

### Library data of the parts
BLU1 = NORDIC HEADER BLUTOOTH: BLUTOOTH MODULE; Value: 1K; Published: 8-Jun-2000; LatestRevisionDate: 29-May-2009; LatestRevisionNote: IPC-7351 Footprint Added.; PackageReference: J1-0603; Publisher: Altium Limited; PackageDescription: Chip Resistor
J5-J14 J21 = CMP-1014-00001-1: as J4 on sheet ChannelDriver; Technology: SMT; Power: None; Value: 0.00 Ohm; OrderURL: http://www.digikey.ie/product-detail/en/yageo/RC0603JR-070RL/311-0.0GRCT-ND/729622; Supplier 1: Digi-Key; Supplier Part Number 1: 311-0.0GRCT-ND
MCU1 = TEENSY 3.2: MCU; Published: 8-Jun-2000; LatestRevisionDate: 29-May-2009; LatestRevisionNote: IPC-7351 Footprint Added.; PackageReference: J1-0603; Publisher: Altium Limited; PackageDescription: Chip Resistor
P3 P6-P8 = CMP-1024-00368-1: Manufacturer: Samtec; Pitch: 2.54 mm; DatasheetVersion: F-214; PackageDescription: .025[0.64] SQ. Post Terminal Strip Assembly; PartNumber: TSW-105-15-T-D; PackageReference: TSW-105-15-X-D; ComponentLink2URL: http://www.samtec.com/documents/webfiles/pdf/TSW_TH.PDF; ComponentLink1URL: http://www.samtec.com; ComponentLink2Description: Datasheet; ComponentLink3Description: Package Specification; PackageVersion: DM, 8/1988; Mounting Technology: Through-hole; Temperature Range: -55 to 105 degC; ComponentLink1Description: Manufacturer URL; RoHS: True; ComponentLink3URL: http://www.samtec.com/documents/webfiles/cpdf/TSW-XXX-XX-XXX-X-XX-XXX-MKT.pdf; Orientation: Vertical
R17-R24 = CMP-1012-00074-1: as R3 on sheet ChannelDriver; Technology: SMT; Tolerance: 5 %; Power: 0.1 W; OrderURL: http://www.digikey.ie/product-detail/en/yageo/RC0603JR-071KL/311-1.0KGRCT-ND/729624; Supplier 1: Digi-Key; Supplier Part Number 1: 311-1.0KGRCT-ND

## Sheet ClockDriver.SchDoc
size A4
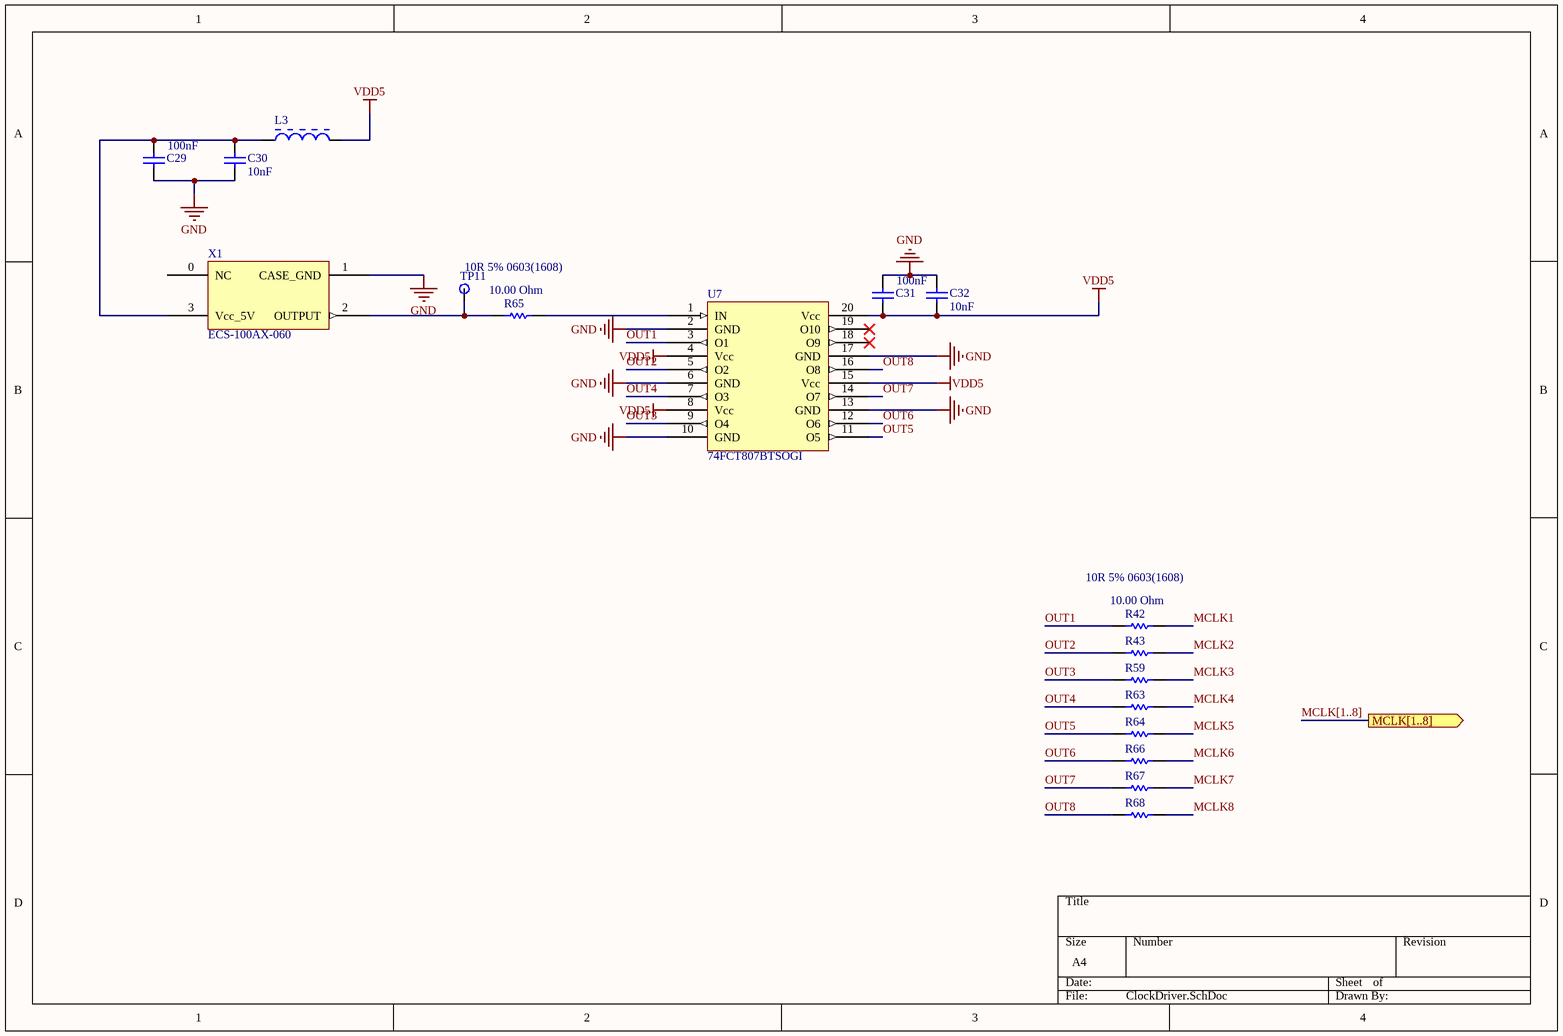
[diagram p3: ClockDriver.SchDoc]

### Parts
C29  value 100nF  [CAPC0603(1608)100_M]  (hidden comment: CAP 100nF 25V 0603(1608))
C30  value 10nF  [CAPC0603(1608)100_N]  (hidden comment: CAP 10nF 25V 0603(1608))
C31  value 100nF  [CAPC0603(1608)100_M]  (hidden comment: CAP 100nF 25V 0603(1608))
C32  value 10nF  [CAPC0603(1608)100_N]  (hidden comment: CAP 10nF 25V 0603(1608))
L3  (no value)  [BOUR-MH1608_V]
R42  10R 5% 0603(1608)  value 10.00 Ohm  [RESC0603(1608)_L]
R43  10R 5% 0603(1608)  [RESC0603(1608)_L]  (value not drawn)
R59  10R 5% 0603(1608)  [RESC0603(1608)_L]  (value not drawn)
R63  10R 5% 0603(1608)  [RESC0603(1608)_L]  (value not drawn)
R64  10R 5% 0603(1608)  [RESC0603(1608)_L]  (value not drawn)
R65  10R 5% 0603(1608)  value 10.00 Ohm  [RESC0603(1608)_L]
R66  10R 5% 0603(1608)  [RESC0603(1608)_L]  (value not drawn)
R67  10R 5% 0603(1608)  [RESC0603(1608)_L]  (value not drawn)
R68  10R 5% 0603(1608)  [RESC0603(1608)_L]  (value not drawn)
TP11  Testpoint  [0603 PROBE PAD]  (value not drawn)
U7  74FCT807BTSOGI  [CLOCK DRIVER 10:1]
X1  ECS-100AX-060  [ECS-100AX-060]

### Ports
MCLK[1..8] (out)

### Nets
GND: C29.2 C30.1 C31.1 C32.2 U7.2(GND) U7.6(GND) U7.10(GND) U7.13(GND) U7.17(GND) X1.1(CASE_GND)
VDD5: C31.2 C32.1 L3.2 U7.4(Vcc) U7.8(Vcc) U7.15(Vcc) U7.20(Vcc)
MCLK1: R42.2  [project net MCLK]
MCLK2: R43.2  [project net MCLK]
MCLK3: R59.2  [project net MCLK]
MCLK4: R63.2  [project net MCLK]
MCLK5: R64.2  [project net MCLK]
MCLK6: R66.2  [project net MCLK]
MCLK7: R67.2  [project net MCLK]
MCLK8: R68.2  [project net MCLK]
OUT1: R42.1 U7.3(O1)
OUT2: R43.1 U7.5(O2)
OUT3: R59.1 U7.9(O4)
OUT4: R63.1 U7.7(O3)
OUT5: R64.1 U7.11(O5)
OUT6: R66.1 U7.12(O6)
OUT7: R67.1 U7.14(O7)
OUT8: R68.1 U7.16(O8)
NetC29_1: C29.1 C30.2 L3.1 X1.3(Vcc_5V)
NetR65_1: R65.1 TP11.0 X1.2(OUTPUT)
NetR65_2: R65.2 U7.1(IN)

Not connected (* = marked no-connect by the designer): U7 18(O9)* 19(O10)*; X1 0(NC)

### Buses and harness runs
bus MCLK[1..8] = port MCLK[1..8]

### Library data of the parts
C29 C31 = CMP-1035-02588-1: as C7 on sheet ChannelDriver; Max Thickness: 1 mm; Technology: SMT; Rated Voltage: 25 V; OrderURL: http://www.digikey.ie/product-detail/en/yageo/CC0603KRX7R8BB104/311-1341-1-ND/2103125; Supplier 1: Digi-Key; Supplier Part Number 1: 311-1341-1-ND
C30 C32 = CMP-1035-02317-1: as C4 on sheet ChannelDriver; Max Thickness: 1 mm; Rated Voltage: 25 V; Technology: SMT; OrderURL: http://www.digikey.ie/product-detail/en/yageo/CC0603KRX7R8BB103/311-1360-1-ND/2103144; Supplier 1: Digi-Key; Supplier Part Number: 311-1360-1-ND; Supplier Part Number 1: 311-1360-1-ND
L3 = CMP-2000-06698-1: Chip Bead, 600 Ohm, 1 A, -55 to 125 degC, 2-Pin SMD (0603), RoHS, Tape and Reel; Manufacturer: Bourns; Manufacturer Part Number: 742792651; Impedance @ Frequency: 600Ohm@100MHz; DC Resistance (DCR) (Max): 200mOhm; Current Rating (Max): 1A; EDA / CAD Models: DownloadfromAcceleratedDesigns; Filter Type: Power,SignalLine; Number of Lines: 1; Description: FERRITE BEAD 600 OHM 0603 1LN; Mounting Type: SurfaceMount; Package Description: 2-Pin Surface Mount Device, Body 1.6 x 0.8 mm; Category: Filters; Packaging: CutTape(CT); Family: FerriteBeadsandChips; Datasheet Version: 03/2015; Standard Package: 1; Mounting Technology: SurfaceMount; Package / Case: 0603(1608Metric); Datasheet URL: http://www.bourns.com/docs/Product-Datasheets/mh.pdf; Operating Temperature: -55°C~125°C; Ratings: -; Package Reference: 0603; Supplier 1: Digi-Key; Supplier Part Number 1: 732-1593-1-ND; RoHS: RoHS Compliant; Stock 1: 145339; Pricing 1: 1=0.15, 50=0.1546, 100=0.1426, 500=0.13616, 1000=0.12972 (EUR); Part Status: Active; Height (Max): 0.039" (1.00mm); Size / Dimension: 0.063" L x 0.032" W (1.60mm x 0.80mm); ComponentLink1URL: http://katalog.we-online.de/pbs/datasheet/742792651.pdf; ComponentLink1Description: http://katalog.we-online.de/pbs/datasheet/742792651.pdf
R42 R43 R59 R63-R68 = CMP-1012-00026-1: 10R 0.1W 5% 0603 (1608 Metric)  SMD; Manufacturer: Yageo; Manufacturer Part Number: RC0603JR-0710RL; Case-Metric: 1608; Case-EIA: 0603; Description: RES SMD 10 OHM 5% 1/10W 0603; Power (Watts): 0.1W, 1/10W; Temperature Coefficient: ±200ppm/°C; Technology: SMT; Tolerance: 5 %; Power: 0.1 W; Supplier 1: Digi-Key; Supplier Part Number 1: 311-10GRCT-ND; RoHS: RoHS Compliant; Category: Resistors; Stock 1: 1131181; Pricing 1: 1=0.09, 10=0.009, 100=0.004, 1000=0.00178, 2500=0.00155 (EUR); Packaging: Cut Tape (CT); Part Status: Active; Composition: Thick Film; Features: Moisture Resistant; Operating Temperature: -55°C ~ 155°C; Package / Case: 0603 (1608 Metric); Supplier Device Package: 0603; Size / Dimension: 0.063" L x 0.032" W (1.60mm x 0.80mm); Height - Seated (Max): 0.022" (0.55mm); Failure Rate: -; ComponentLink1URL: http://www.yageo.com/documents/recent/PYu-RC_Group_51_RoHS_L_8.pdf; ComponentLink1Description: http://www.yageo.com/documents/recent/PYu-RC_Group_51_RoHS_L_8.pdf
TP11 = Testpoint: as TP3 on sheet ChannelDriver; OrderURL: http://www.digikey.ie/product-detail/en/te-connectivity-amp-connectors/RCU-0C/A106145CT-ND/3477802; Value: *; Width: 0.8; Height: 1.15mm; Length: 1.60mm; Supplier Part Number 1: A106145CT-ND; Supplier 1: Digi-Key
U7 = 74FCT807BTSOGI: IC CLK BUFFER 1:10 100MHZ 20SOIC; Manufacturer: IDT, Integrated Device Technology Inc; Number of Circuits: 1; Differential - Input:Output: No/No; Input: TTL; Voltage - Supply: 4.75 V ~ 5.25 V; Published: 8-Jun-2000; LatestRevisionDate: 29-May-2009; LatestRevisionNote: IPC-7351 Footprint Added.; PackageReference: J1-0603; Publisher: Altium Limited; PackageDescription: Chip Resistor; Manufacturer Part Number: 74FCT807BTSOGI; RoHS: RoHS Compliant; Category: Integrated Circuits (ICs); Packaging: Tube; Part Status: Active; Type: Fanout Buffer (Distribution); Ratio - Input:Output: 1:10; Output: TTL; Frequency - Max: 100MHz; Operating Temperature: -40°C ~ 85°C; Mounting Type: Surface Mount; Package / Case: 20-SOIC (0.295", 7.50mm Width); Supplier Device Package: 20-SOIC; ComponentLink1URL: http://www.idt.com/document/74fct807t-datasheet; ComponentLink1Description: http://www.idt.com/document/74fct807t-datasheet; Supplier 1: Digi-Key; Supplier Part Number 1: 800-3327-5-ND; Stock 1: 281; Pricing 1: 1=3.79, 10=3.384, 25=3.0456, 100=2.7751, 250=2.5044, 500=2.24718, 1000=1.89521, 2500=1.80045, 5000=1.73276 (EUR)
X1 = ECS-100AX-060: OSC XO 6.000MHZ TTL PC PIN; Manufacturer: ECS Inc.; Frequency: 6MHz; Voltage - Supply: 5V; Frequency Stability: ±100ppm; Current - Supply (Max): 15mA; Value: 6Mhz; Published: 8-Jun-2000; LatestRevisionDate: 29-May-2009; LatestRevisionNote: IPC-7351 Footprint Added.; PackageReference: J1-0603; Publisher: Altium Limited; PackageDescription: Chip Resistor; Manufacturer Part Number: ECS-100AX-060; RoHS: RoHS Compliant; Category: Crystals, Oscillators, Resonators; Packaging: Bulk; Part Status: Active; Type: XO (Standard); Function: -; Output: TTL; Operating Temperature: 0°C ~ 70°C; Ratings: -; Mounting Type: Through Hole; Package / Case: 14-DIP, 4 Leads (Full Size, Metal Can); Size / Dimension: 0.821" L x 0.520" W (20.86mm x 13.20mm); Height - Seated (Max): 0.200" (5.08mm); Current - Supply (Disable) (Max): -; ComponentLink1URL: http://www.ecsxtal.com/store/pdf/ecs-100x.pdf; ComponentLink1Description: http://www.ecsxtal.com/store/pdf/ecs-100x.pdf; Supplier 1: Digi-Key; Supplier Part Number 1: X943-ND; Stock 1: 1021; Pricing 1: 1=2.21, 10=2.157, 50=2.054, 100=1.7972, 500=1.74584, 1000=1.48909, 2500=1.3864, 5000=1.33505 (EUR)